# Altium schematic sheet DHT11.SchDoc
size A; SheetNumber: 8; SheetTotal: 9
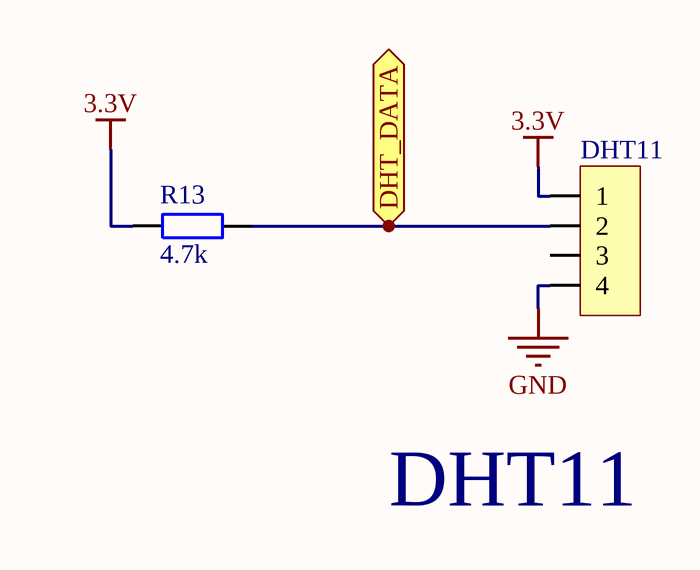
[diagram p0: DHT11.SchDoc]

## Parts
DHT11  JP 1x4 2.54  [JP 1x4 CT]  (value not drawn)
R13  4.7k  [tro smd 0603]

## Ports
DHT_DATA (bidir)

## Nets
3.3V: DHT11.1 R13.1
GND: DHT11.4
DHT_DATA: DHT11.2 R13.2 ; port DHT_DATA

Not connected (* = marked no-connect by the designer): DHT11 3

## Notes on the sheet
- DHT11

## Library data of the parts
DHT11 = JP 1x4 2.54 Cai Thang: Cắm; Ten_Linh_Kien: Jump Đơn Cái 2.54MM 1x20P Thẳng; Don_Vi: Con; Ma_Hang: MH004006; Ghi_Chu: *; Kieu_Chan: *; Chung_Loai: Cắm
R13 = Tro 0603 5% 4.7k: Dán; Don_Vi: Con; So_Chan: 2; Ten_Linh_Kien: Trở 0603 5% 4.7k; Ma_Hang: MH006327; Chung_Loai: Dán; Kieu_Chan: *